# EAGLE schematic untitled (EAGLE 9.6.2)
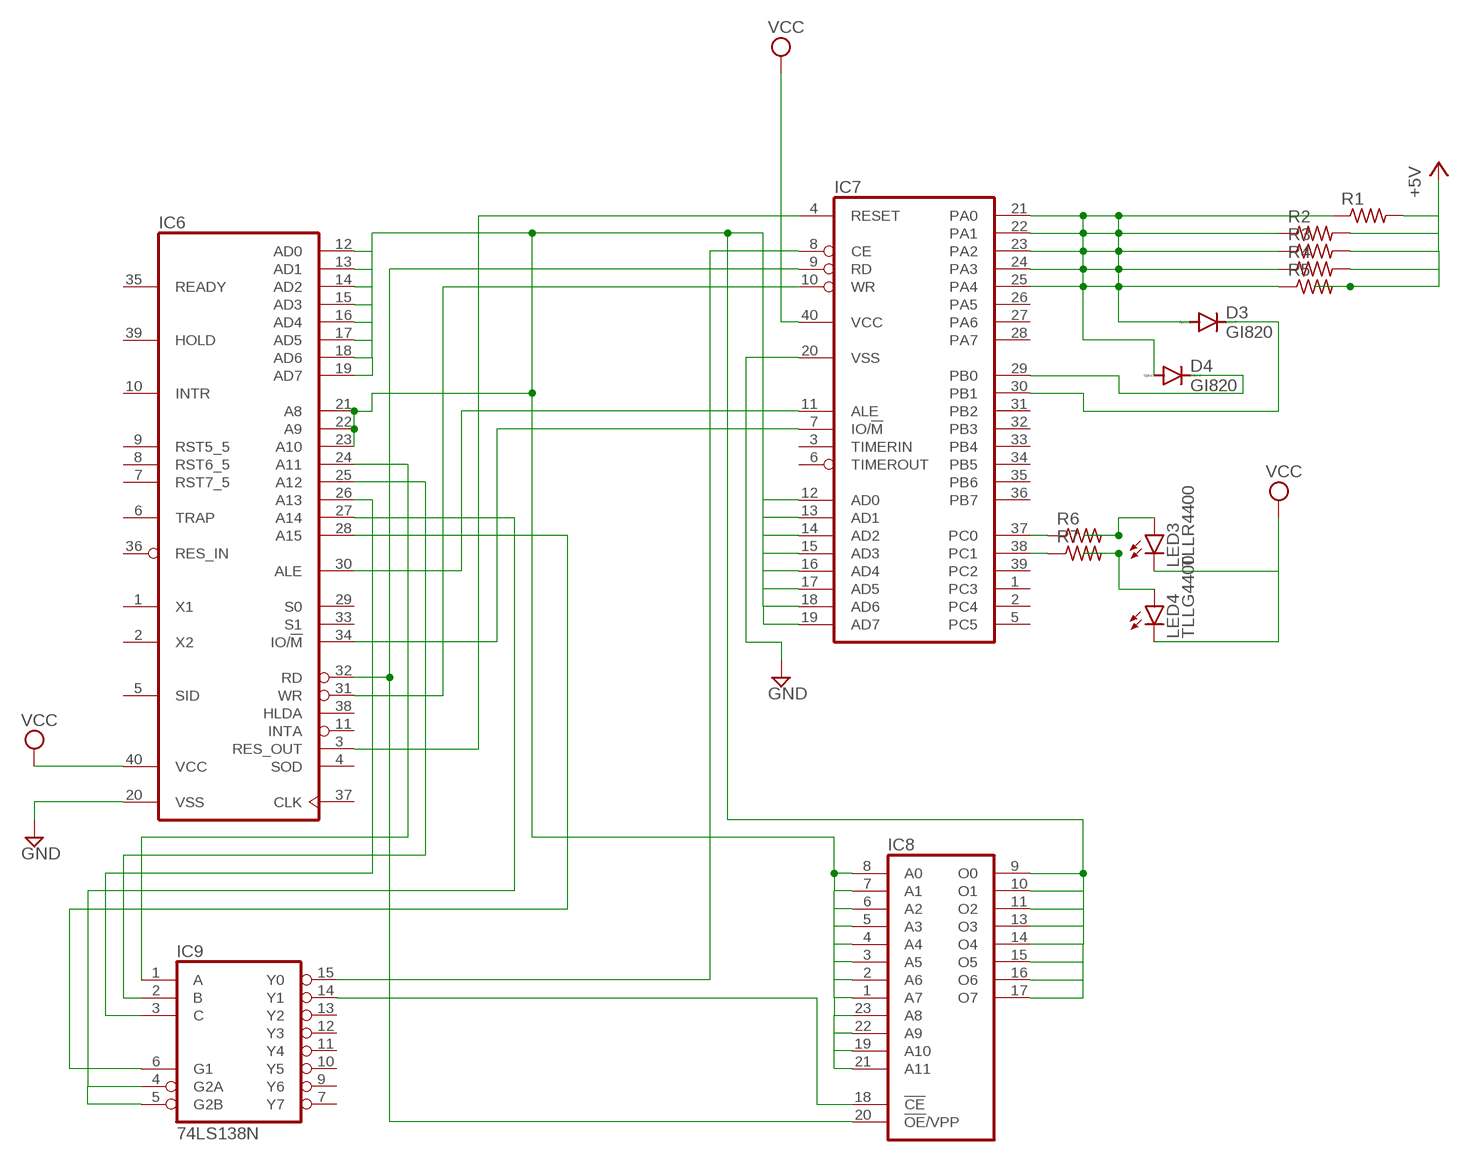
[diagram p0: schematic, sheet 1]

## Parts
D3  GI820  [P6-15]
D4  GI820  [P6-15]
IC6  8085  [DIL40]
IC7  8155  [DIL40]
IC8  2732  [DIL24]
IC9  74LS138N  [DIL16]
LED3  TLLR4400  [LED3MM]
LED4  TLLG4400  [LED3MM]
R1  R-US_0207/10  [0207/10]
R2  R-US_0207/10  [0207/10]
R3  R-US_0207/10  [0207/10]
R4  R-US_0207/10  [0207/10]
R5  R-US_0207/10  [0207/10]
R6  R-US_0207/10  [0207/10]
R7  R-US_0207/10  [0207/10]

## Nets
+5V: R2.2 R3.2 R4.2 R5.2
GND: IC6.20(VSS) IC7.20(VSS)
N$18: R1.2
N$19: D3.C IC7.30(PB1)
N$20: D4.C IC7.29(PB0)
N$21: IC6.32(RD) IC7.9(RD) IC8.20(!OE!/VPP)
N$22: IC6.31(WR) IC7.10(WR)
N$23: IC6.30(ALE) IC7.11(ALE)
N$24: IC6.3(RES_OUT) IC7.4(RESET)
N$25: IC6.34(IO/!M) IC7.7(IO/!M)
N$27: IC6.27(A14) IC9.4(G2A) IC9.5(G2B)
N$28: IC7.8(CE) IC9.15(Y0)
N$30: D3.A D4.A IC7.21(PA0) IC7.22(PA1) IC7.23(PA2) IC7.24(PA3) IC7.25(PA4) R1.1 R2.1 R3.1 R4.1 R5.1
N$31: IC8.11(O2) IC8.14(O4) IC8.15(O5) IC8.16(O6) IC8.17(O7)
N$32: IC6.28(A15) IC9.6(G1)
N$33: LED3.A R6.2
N$34: LED4.A R7.2
N$35: IC7.37(PC0) R6.1
N$36: IC7.38(PC1) R7.1
N$37: IC8.18(!CE) IC9.14(Y1)
N$38: IC6.12(AD0) IC6.13(AD1) IC6.14(AD2) IC6.15(AD3) IC6.16(AD4) IC6.17(AD5) IC6.18(AD6) IC6.19(AD7) IC6.21(A8) IC6.22(A9) IC6.23(A10) IC7.12(AD0) IC7.13(AD1) IC7.14(AD2) IC7.15(AD3) IC7.16(AD4) IC7.17(AD5) IC7.18(AD6) IC7.19(AD7) IC8.1(A7) IC8.2(A6) IC8.3(A5) IC8.4(A4) IC8.5(A3) IC8.6(A2) IC8.7(A1) IC8.8(A0) IC8.9(O0) IC8.10(O1) IC8.13(O3) IC8.19(A10) IC8.21(A11) IC8.22(A9) IC8.23(A8)
N$39: IC6.24(A11) IC9.1(A)
N$40: IC6.25(A12) IC9.2(B)
N$41: IC6.26(A13) IC9.3(C)
VCC: IC6.40(VCC) IC7.40(VCC) LED3.K(C) LED4.K(C)
Unconnected: IC6.1(X1) IC6.2(X2) IC6.4(SOD) IC6.5(SID) IC6.6(TRAP) IC6.7(RST7_5) IC6.8(RST6_5) IC6.9(RST5_5) IC6.10(INTR) IC6.11(INTA) IC6.29(S0) IC6.33(S1) IC6.35(READY) IC6.36(RES_IN) IC6.37(CLK) IC6.38(HLDA) IC6.39(HOLD) IC7.1(PC3) IC7.2(PC4) IC7.3(TIMERIN) IC7.5(PC5) IC7.6(TIMEROUT) IC7.26(PA5) IC7.27(PA6) IC7.28(PA7) IC7.31(PB2) IC7.32(PB3) IC7.33(PB4) IC7.34(PB5) IC7.35(PB6) IC7.36(PB7) IC7.39(PC2) IC9.7(Y7) IC9.9(Y6) IC9.10(Y5) IC9.11(Y4) IC9.12(Y3) IC9.13(Y2)

## Power pins joined to a net without a drawn wire
GND: IC8.12(GND) IC9.8(GND)
VCC: IC8.24(VCC) IC9.16(VCC)

## Library data of the parts
D3 D4 = diode:GI820: DIODE fast-recovery silicon diode, 6 A (Diotec)
IC6 = micro-intel:8085: MICROCOMPUTER/PERIPHERAL DEVICE; OC_FARNELL: unknown; OC_NEWARK: unknown
IC7 = micro-intel:8155: MICROCOMPUTER/PERIPHERAL DEVICE; OC_FARNELL: unknown; OC_NEWARK: unknown
IC8 = memory:2732: MEMORY
IC9 = 74xx-us:74*138: 3-line to 8-line DECODER/DEMULTIPLEXER
LED3 = led:TLLR4400: Low Current (2mA) LED 3 mm Tinted Diffused Package color RED Source: Data sheet <http://www.farnell.com/datasheets/391100.pdf>; MF: VISHAY SEMICONDUCTOR; OC_FARNELL: 1612437
LED4 = led:TLLG4400: Low Current (2mA) LED 3 mm Tinted Diffused Package color GREEN Source: Data sheet <http://www.farnell.com/datasheets/391098.pdf>; MF: VISHAY SEMICONDUCTOR; OC_FARNELL: 1612435
R1-R7 = rcl:R-US_: RESISTOR, American symbol; SPICEPREFIX: R